# EAGLE schematic esp12carrier_3 (EAGLE 7.6.0)
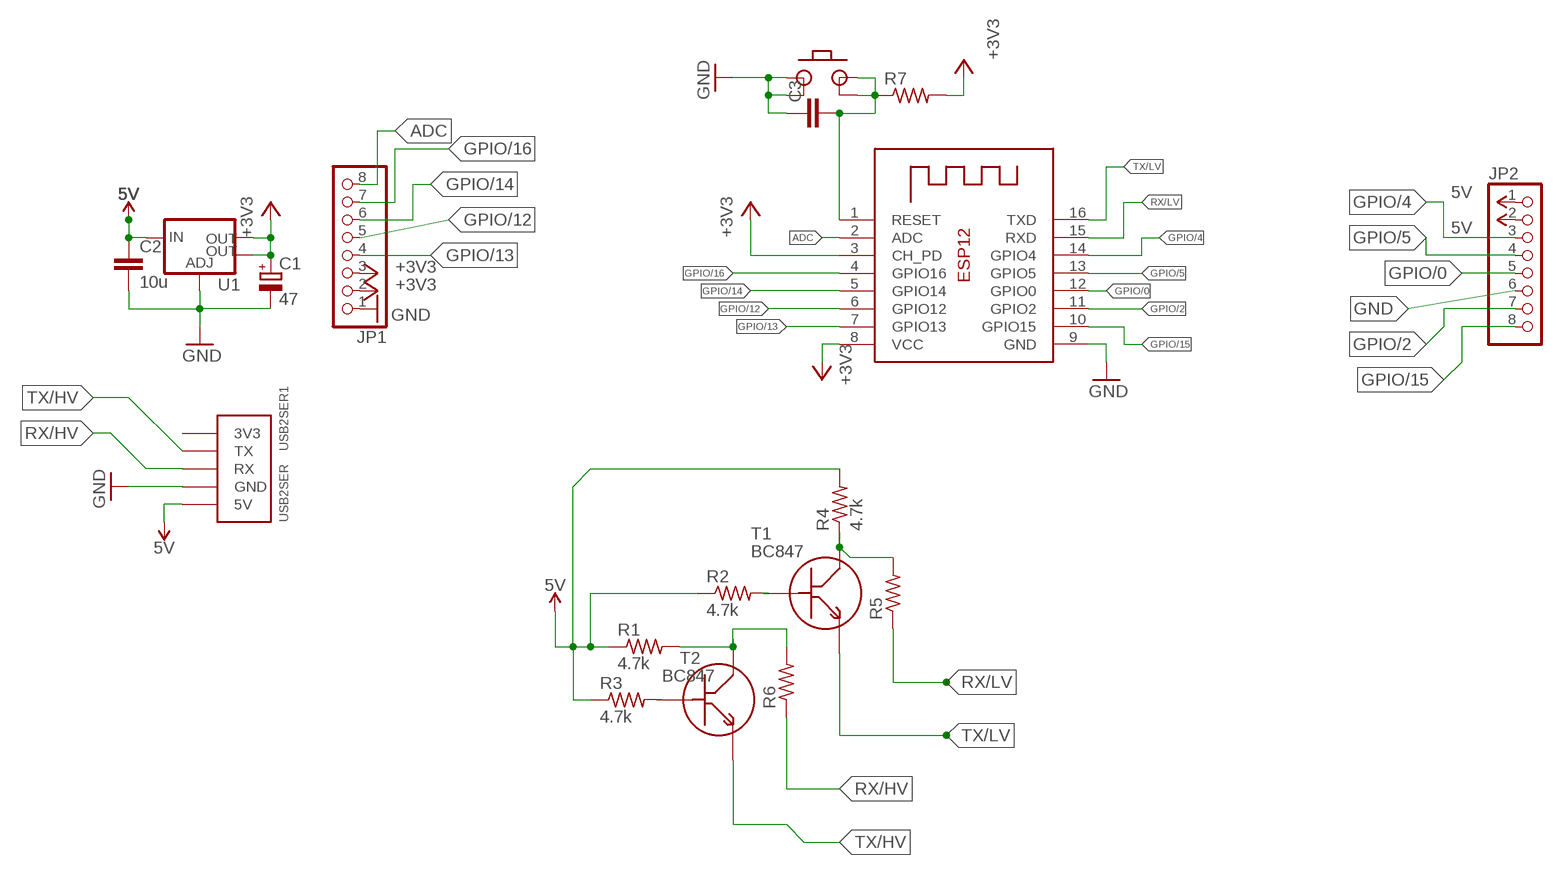
[diagram p0: schematic, sheet 1]

## Parts
C1  47  CPOL-EU150CLZ-0810  [150CLZ-0810]
C2  10u  C-EUC0805  [C0805]
C3  C-EUC0805  [C0805]
JP1  PINHD-1X8  [1X08]
JP2  PINHD-1X8  [1X08]
PB1  TACTSW  [TACTSW]
R1  4.7k  R-US_M0805  [M0805]
R2  4.7k  R-US_M0805  [M0805]
R3  4.7k  R-US_M0805  [M0805]
R4  4.7k  R-US_M0805  [M0805]
R5  R-US_M0805  [M0805]
R6  R-US_M0805  [M0805]
R7  R-US_M0805  [M0805]
T1  BC847  [BC847]
T2  BC847  [BC847]
U1  V_REG_LM1117SOT223  [SOT223]
USB2SER1  USB2SER  [USB2SER]
X2  ESP-12  [ESP-12]

## Nets
5V: C2.1 JP2.1 JP2.2 R1.1 R2.1 R3.1 R4.2 U1.3(IN) USB2SER1.P$5(5V)
+3V3: C1.+ JP1.2 JP1.3 R7.2 U1.2(OUT) U1.4(OUT) X2.3(CH_PD) X2.8(VCC)
ADC: JP1.8 X2.2(ADC)
GND: C1.- C2.2 C3.1 JP1.1 JP2.6 PB1.P$1 PB1.P$2 U1.1(ADJ) USB2SER1.P$4(GND) X2.9(GND)
GPIO/0: JP2.5 X2.12(GPIO0)
GPIO/2: JP2.7 X2.11(GPIO2)
GPIO/4: JP2.3 X2.14(GPIO4)
GPIO/5: JP2.4 X2.13(GPIO5)
GPIO/12: JP1.5 X2.6(GPIO12)
GPIO/13: JP1.4 X2.7(GPIO13)
GPIO/14: JP1.6 X2.5(GPIO14)
GPIO/15: JP2.8 X2.10(GPIO15)
GPIO/16: JP1.7 X2.4(GPIO16)
N$1: R2.2 T1.P$2(B)
N$2: R1.2 R6.2 T2.P$1(C)
N$19: R3.2 T2.P$2(B)
N$21: R4.1 R5.2 T1.P$1(C)
N$23: C3.2 PB1.P$3 PB1.P$4 R7.1 X2.1(RESET)
RX/HV: R6.1 USB2SER1.P$3(RX)
RX/LV: R5.1 X2.15(RXD)
TX/HV: T2.P$3(E) USB2SER1.P$2(TX)
TX/LV: T1.P$3(E) X2.16(TXD)

## Power pins joined to a net without a drawn wire
3V3: USB2SER1.P$1(3V3)

## Library data of the parts
C1 = resistor:CPOL-EU: POLARIZED CAPACITOR, European symbol
C2 C3 = resistor:C-EU: CAPACITOR, European symbol
JP1 JP2 = pinhead:PINHD-1X8: PIN HEADER
PB1 = TACTSW:TACTSW
R1-R7 = resistor:R-US_: RESISTOR, American symbol
T1 T2 = Arpit's Lib:BC847
U1 = SparkFun-IC-Power:V_REG_LM1117: Voltage Regulator LM1117 Standard adjustable voltage regulator but in SMD form. Spark Fun Electronics SKU : COM-00595; PROD_ID: VREG-08170
USB2SER1 = Arpit's Lib:USB2SER
X2 = adafruit:ESP-12